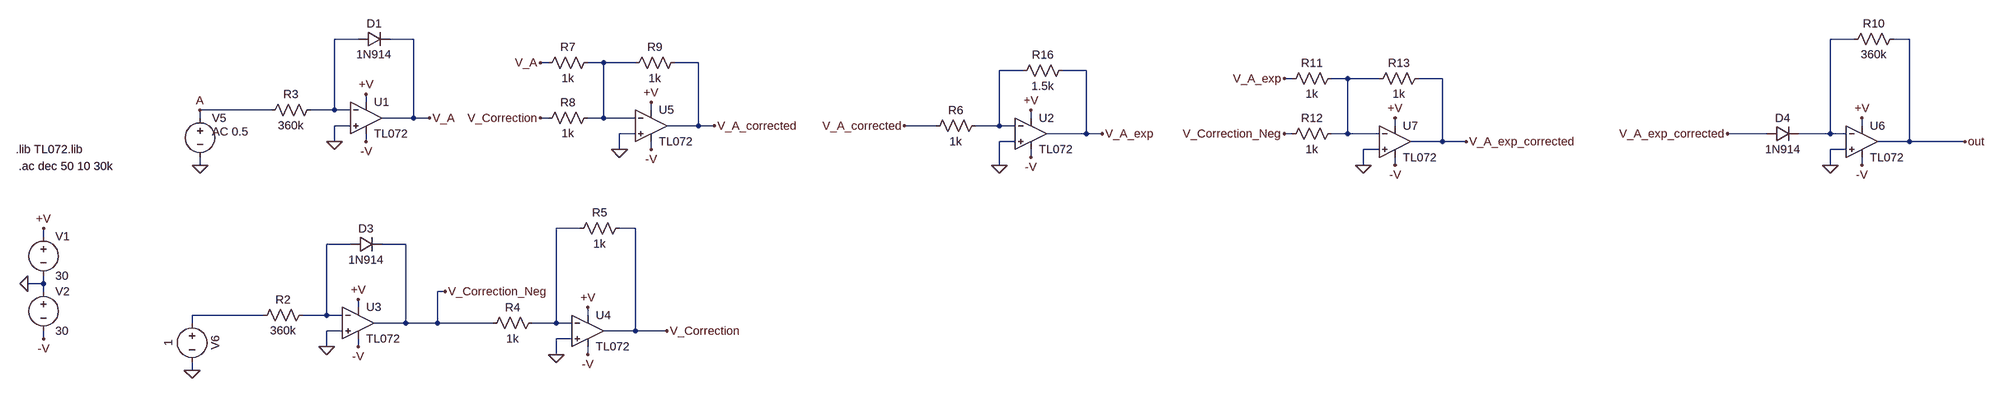
[diagram p0: schematic Multiplier.asc]
Multiplier.asc, the LTspice schematic file:
Version 4
SHEET 1 4216 764
WIRE 576 -496 528 -496
WIRE 688 -496 640 -496
WIRE 3600 -496 3552 -496
WIRE 3712 -496 3680 -496
WIRE 960 -448 944 -448
WIRE 1072 -448 1040 -448
WIRE 1136 -448 1072 -448
WIRE 1264 -448 1216 -448
WIRE 1920 -432 1872 -432
WIRE 2048 -432 2000 -432
WIRE 2464 -416 2448 -416
WIRE 2576 -416 2544 -416
WIRE 2640 -416 2576 -416
WIRE 2768 -416 2720 -416
WIRE 592 -368 592 -384
WIRE 400 -352 256 -352
WIRE 528 -352 528 -496
WIRE 528 -352 480 -352
WIRE 560 -352 528 -352
WIRE 1168 -352 1168 -368
WIRE 256 -336 256 -352
WIRE 688 -336 688 -496
WIRE 688 -336 624 -336
WIRE 720 -336 688 -336
WIRE 960 -336 944 -336
WIRE 1072 -336 1072 -448
WIRE 1072 -336 1040 -336
WIRE 1136 -336 1072 -336
WIRE 1936 -336 1936 -352
WIRE 560 -320 528 -320
WIRE 1264 -320 1264 -448
WIRE 1264 -320 1200 -320
WIRE 1296 -320 1264 -320
WIRE 1744 -320 1680 -320
WIRE 1872 -320 1872 -432
WIRE 1872 -320 1824 -320
WIRE 1904 -320 1872 -320
WIRE 2672 -320 2672 -336
WIRE 3616 -320 3616 -336
WIRE 1136 -304 1104 -304
WIRE 2048 -304 2048 -432
WIRE 2048 -304 1968 -304
WIRE 2080 -304 2048 -304
WIRE 2464 -304 2448 -304
WIRE 2576 -304 2576 -416
WIRE 2576 -304 2544 -304
WIRE 2640 -304 2576 -304
WIRE 3424 -304 3344 -304
WIRE 3552 -304 3552 -496
WIRE 3552 -304 3488 -304
WIRE 3584 -304 3552 -304
WIRE 528 -288 528 -320
WIRE 592 -288 592 -304
WIRE 1904 -288 1872 -288
WIRE 2768 -288 2768 -416
WIRE 2768 -288 2704 -288
WIRE 2816 -288 2768 -288
WIRE 3712 -288 3712 -496
WIRE 3712 -288 3648 -288
WIRE 3824 -288 3712 -288
WIRE 1104 -272 1104 -304
WIRE 1168 -272 1168 -288
WIRE 2640 -272 2608 -272
WIRE 3584 -272 3552 -272
WIRE 1936 -256 1936 -272
WIRE 256 -240 256 -256
WIRE 1872 -240 1872 -288
WIRE 2608 -240 2608 -272
WIRE 2672 -240 2672 -256
WIRE 3552 -240 3552 -272
WIRE 3616 -240 3616 -256
WIRE 1024 -112 976 -112
WIRE 1136 -112 1104 -112
WIRE -192 -96 -192 -112
WIRE 560 -80 512 -80
WIRE 672 -80 624 -80
WIRE -192 0 -192 -16
WIRE -192 0 -224 0
WIRE -192 16 -192 0
WIRE 752 16 736 16
WIRE 576 48 576 32
WIRE 384 64 240 64
WIRE 512 64 512 -80
WIRE 512 64 464 64
WIRE 544 64 512 64
WIRE 1040 64 1040 48
WIRE 240 80 240 64
WIRE 672 80 672 -80
WIRE 672 80 608 80
WIRE 736 80 736 16
WIRE 736 80 672 80
WIRE 848 80 736 80
WIRE 976 80 976 -112
WIRE 976 80 928 80
WIRE 1008 80 976 80
WIRE 544 96 512 96
WIRE 1136 96 1136 -112
WIRE 1136 96 1072 96
WIRE 1200 96 1136 96
WIRE -192 112 -192 96
WIRE 1008 112 976 112
WIRE 512 128 512 96
WIRE 576 128 576 112
WIRE 976 144 976 112
WIRE 1040 144 1040 128
WIRE 240 176 240 160
FLAG -224 0 0
FLAG -192 -112 +V
FLAG -192 112 -V
FLAG 576 128 -V
FLAG 512 128 0
FLAG 240 176 0
FLAG 592 -384 +V
FLAG 592 -288 -V
FLAG 528 -288 0
FLAG 256 -240 0
FLAG 1040 48 +V
FLAG 1040 144 -V
FLAG 976 144 0
FLAG 1200 96 V_Correction
FLAG 944 -448 V_A
FLAG 944 -336 V_Correction
FLAG 1168 -368 +V
FLAG 1168 -272 -V
FLAG 1104 -272 0
FLAG 1296 -320 V_A_corrected
FLAG 3616 -336 +V
FLAG 3616 -240 -V
FLAG 3552 -240 0
FLAG 576 32 +V
FLAG 256 -352 A
FLAG 3824 -288 out
FLAG 752 16 V_Correction_Neg
FLAG 1936 -352 +V
FLAG 1936 -256 -V
FLAG 1680 -320 V_A_corrected
FLAG 2672 -336 +V
FLAG 2672 -240 -V
FLAG 2608 -240 0
FLAG 2448 -416 V_A_exp
FLAG 2080 -304 V_A_exp
FLAG 2816 -288 V_A_exp_corrected
FLAG 2448 -304 V_Correction_Neg
FLAG 3344 -304 V_A_exp_corrected
FLAG 1872 -240 0
FLAG 720 -336 V_A
SYMBOL voltage -192 -112 R0
WINDOW 123 0 0 Left 0
WINDOW 39 0 0 Left 0
SYMATTR InstName V1
SYMATTR Value 30
SYMBOL voltage -192 0 R0
WINDOW 123 0 0 Left 0
WINDOW 39 0 0 Left 0
SYMATTR InstName V2
SYMATTR Value 30
SYMBOL voltage 240 64 R0
WINDOW 0 32 56 VTop 2
WINDOW 3 -32 56 VBottom 2
WINDOW 123 0 0 Left 0
WINDOW 39 0 0 Left 0
SYMATTR InstName V6
SYMATTR Value 1
SYMBOL res 496 -368 R90
WINDOW 0 0 56 VBottom 2
WINDOW 3 32 56 VTop 2
SYMATTR InstName R3
SYMATTR Value 360k
SYMBOL voltage 256 -352 R0
WINDOW 123 24 44 Left 2
WINDOW 39 0 0 Left 0
WINDOW 3 24 72 Invisible 2
SYMATTR Value2 AC 0.5
SYMATTR InstName V5
SYMATTR Value 1
SYMBOL res 944 64 R90
WINDOW 0 0 56 VBottom 2
WINDOW 3 32 56 VTop 2
SYMATTR InstName R4
SYMATTR Value 1k
SYMBOL res 1120 -128 R90
WINDOW 0 0 56 VBottom 2
WINDOW 3 32 56 VTop 2
SYMATTR InstName R5
SYMATTR Value 1k
SYMBOL res 1056 -464 R90
WINDOW 0 0 56 VBottom 2
WINDOW 3 32 56 VTop 2
SYMATTR InstName R7
SYMATTR Value 1k
SYMBOL res 1056 -352 R90
WINDOW 0 0 56 VBottom 2
WINDOW 3 32 56 VTop 2
SYMATTR InstName R8
SYMATTR Value 1k
SYMBOL res 1232 -464 R90
WINDOW 0 0 56 VBottom 2
WINDOW 3 32 56 VTop 2
SYMATTR InstName R9
SYMATTR Value 1k
SYMBOL diode 576 -480 R270
WINDOW 0 32 32 VTop 2
WINDOW 3 0 32 VBottom 2
SYMATTR InstName D1
SYMATTR Value 1N914
SYMBOL diode 560 -64 R270
WINDOW 0 32 32 VTop 2
WINDOW 3 0 32 VBottom 2
SYMATTR InstName D3
SYMATTR Value 1N914
SYMBOL diode 3424 -288 R270
WINDOW 0 32 32 VTop 2
WINDOW 3 0 32 VBottom 2
SYMATTR InstName D4
SYMATTR Value 1N914
SYMBOL OpAmps\\opamp2 592 -400 R0
SYMATTR InstName U1
SYMATTR Value TL072
SYMBOL OpAmps\\opamp2 576 16 R0
SYMATTR InstName U3
SYMATTR Value TL072
SYMBOL OpAmps\\opamp2 1040 32 R0
SYMATTR InstName U4
SYMATTR Value TL072
SYMBOL OpAmps\\opamp2 1168 -384 R0
SYMATTR InstName U5
SYMATTR Value TL072
SYMBOL OpAmps\\opamp2 3616 -352 R0
SYMATTR InstName U6
SYMATTR Value TL072
SYMBOL res 480 48 R90
WINDOW 0 0 56 VBottom 2
WINDOW 3 32 56 VTop 2
SYMATTR InstName R2
SYMATTR Value 360k
SYMBOL res 3696 -512 R90
WINDOW 0 0 56 VBottom 2
WINDOW 3 32 56 VTop 2
SYMATTR InstName R10
SYMATTR Value 360k
SYMBOL OpAmps\\opamp2 1936 -368 R0
SYMATTR InstName U2
SYMATTR Value TL072
SYMBOL res 2560 -432 R90
WINDOW 0 0 56 VBottom 2
WINDOW 3 32 56 VTop 2
SYMATTR InstName R11
SYMATTR Value 1k
SYMBOL res 2560 -320 R90
WINDOW 0 0 56 VBottom 2
WINDOW 3 32 56 VTop 2
SYMATTR InstName R12
SYMATTR Value 1k
SYMBOL res 2736 -432 R90
WINDOW 0 0 56 VBottom 2
WINDOW 3 32 56 VTop 2
SYMATTR InstName R13
SYMATTR Value 1k
SYMBOL OpAmps\\opamp2 2672 -352 R0
SYMATTR InstName U7
SYMATTR Value TL072
SYMBOL res 1728 -304 R270
WINDOW 0 32 56 VTop 2
WINDOW 3 0 56 VBottom 2
SYMATTR InstName R6
SYMATTR Value 1k
SYMBOL res 2016 -448 R90
WINDOW 0 0 56 VBottom 2
WINDOW 3 32 56 VTop 2
SYMATTR InstName R16
SYMATTR Value 1.5k
TEXT -248 -272 Left 2 !.lib TL072.lib
TEXT -242 -238 Left 2 !.ac dec 50 10 30k

The netlist it stands for:
* Multiplier.asc
V1 +V 0 30
V2 0 -V 30
V6 N008 0 1
R3 N001 A 360k
V5 A 0 1 AC 0.5
R4 N006 V_Correction_Neg 1k
R5 V_Correction N006 1k
R7 N003 V_A 1k
R8 N003 V_Correction 1k
R9 V_A_corrected N003 1k
D1 N001 V_A 1N914
D3 N007 V_Correction_Neg 1N914
D4 V_A_exp_corrected N002 1N914
XU1 0 N001 +V -V V_A TL072  ; pins In+ In- V+ V- OUT
XU3 0 N007 +V -V V_Correction_Neg TL072  ; pins In+ In- V+ V- OUT
XU4 0 N006 +V -V V_Correction TL072  ; pins In+ In- V+ V- OUT
XU5 0 N003 +V -V V_A_corrected TL072  ; pins In+ In- V+ V- OUT
XU6 0 N002 +V -V out TL072  ; pins In+ In- V+ V- OUT
R2 N007 N008 360k
R10 out N002 360k
XU2 0 N004 +V -V V_A_exp TL072  ; pins In+ In- V+ V- OUT
R11 N005 V_A_exp 1k
R12 N005 V_Correction_Neg 1k
R13 V_A_exp_corrected N005 1k
XU7 0 N005 +V -V V_A_exp_corrected TL072  ; pins In+ In- V+ V- OUT
R6 V_A_corrected N004 1k
R16 V_A_exp N004 1.5k
.model D D
.lib standard.dio
.lib TL072.lib
.ac dec 50 10 30k
.backanno
.end